# Altium project Christmas Project.PrjPcb
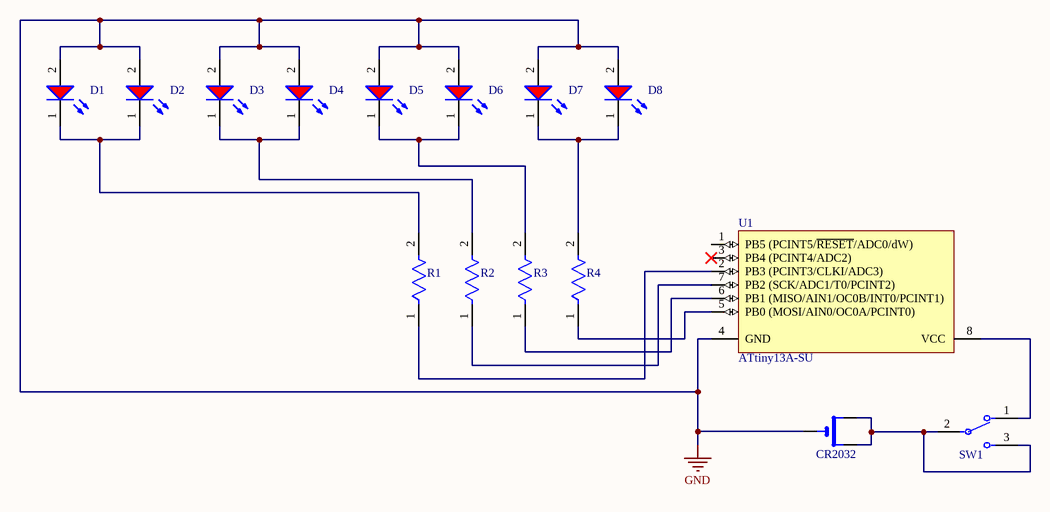
[diagram p0: Christmas_SCH.SchDoc]
1 sheet, 15 parts. Net scope: global (net labels, ports and power ports of the same name join across sheets).
Board files: Christmas_PCB.PcbDoc, Christmas_PCB_V2.PcbDoc

## Sheet Christmas_SCH.SchDoc
size A4; SheetNumber: 1; SheetTotal: 1

### Parts
?  CR2032  [CR2032-SMD]
D1  150080RS75000  [WL-SMCW_0805_150080xx75000]  (value not drawn)
D2  150080RS75000  [WL-SMCW_0805_150080xx75000]  (value not drawn)
D3  150080RS75000  [WL-SMCW_0805_150080xx75000]  (value not drawn)
D4  150080RS75000  [WL-SMCW_0805_150080xx75000]  (value not drawn)
D5  150080RS75000  [WL-SMCW_0805_150080xx75000]  (value not drawn)
D6  150080RS75000  [WL-SMCW_0805_150080xx75000]  (value not drawn)
D7  150080RS75000  [WL-SMCW_0805_150080xx75000]  (value not drawn)
D8  150080RS75000  [WL-SMCW_0805_150080xx75000]  (value not drawn)
R1  CRCW0805330RFKEA  [FP-CRCW0805-e3-MFG]  (value not drawn)
R2  CRCW0805330RFKEA  [FP-CRCW0805-e3-MFG]  (value not drawn)
R3  CRCW0805330RFKEA  [FP-CRCW0805-e3-MFG]  (value not drawn)
R4  CRCW0805330RFKEA  [FP-CRCW0805-e3-MFG]  (value not drawn)
SW1  JS102011SAQN  [FP-JS102011SAQN-MFG]  (value not drawn)
U1  ATtiny13A-SU  [8S2_L]

### Nets
GND: ?.NEG D1.2(A) D2.2(A) D3.2(A) D4.2(A) D5.2(A) D6.2(A) D7.2(A) D8.2(A) U1.4(GND)
Net?_+$1: ?.+$1(POS) ?.+$2(+1) SW1.2(C) SW1.3
NetD1_1: D1.1(K) D2.1(K) R1.2
NetD3_1: D3.1(K) D4.1(K) R2.2
NetD5_1: D5.1(K) D6.1(K) R3.2
NetD7_1: D7.1(K) D8.1(K) R4.2
NetR1_1: R1.1 U1.2(PB3_(PCINT3/CLKI/ADC3))
NetR2_1: R2.1 U1.7(PB2_(SCK/ADC1/T0/PCINT2))
NetR3_1: R3.1 U1.6(PB1_(MISO/AIN1/OC0B/INT0/PCINT1))
NetR4_1: R4.1 U1.5(PB0_(MOSI/AIN0/OC0A/PCINT0))
NetSW1_1: SW1.1 U1.8(VCC)

Not connected (* = marked no-connect by the designer): U1 1(PB5_(PCINT5/~{RESET}/ADC0/dW)) 3(PB4_(PCINT4/ADC2))*

### Library data of the parts
? = CR2032: Coin, 20.0mm Lithium Manganese Dioxide 3V Battery Non-Rechargeable _Primary_; MF: FDK America,; Availability: Unavailable; Price: None; Package: FDK; Value: *; SnapEDA_Link: https://www.snapeda.com/parts/CR2032/FDK%20America%2C%20Inc.%2C%20a%20member%20of%20Fujitsu%20Group/view-part/1775317/?ref=snap; MP: CR2032
D1-D8 = CMP-1426-00011-2: NexarPartId: 29717781; Peak Wavelength: 630nm; Wavelength: 625nm; Viewing Angle: 140°; Test Current: 20mA; Forward Voltage: 2V; Forward Current: 100mA; Lens Style: Clear, Rectangular; Color: Red; Luminous Intensity: 150mcd; Max Reverse Voltage (DC): 5V; Length: 2mm; Case Code (Imperial): 0805; RoHS: Compliant; Max Operating Temperature: 85°C; Height: 700µm; Packaging: Tape and Reel; Case/Package: 0805; REACH SVHC: Unknown; Dominant Wavelength: 625nm; Min Operating Temperature: -40°C; Case Code (Metric): 2012; Mount: Surface Mount; Width: 1.25mm
R1-R4 = CMP-2001-03823-2: RES Thick Film, 330Ω, 1%, 0.125W, 100ppm/°C, 0805; Voltage Rating (DC): 150V; Resistance: 330R; Max Power Dissipation: 125mW; Mount: Surface Mount; Packaging: Tape and Reel; Min Operating Temperature: -55°C; Military Standard: Not; Case Code (Metric): 2012; Height: 0.02inch; Voltage Rating: 150V; Case/Package: 0805; Max Operating Temperature: 155°C; Width: 0.049inch; Case Code (Imperial): 0805; Termination: SMD/SMT; Lead Free: Lead Free; Contact Plating: Tin; Package Quantity: 10; Composition: Thick Film; Length: 2mm; Features: Automotive AEC-Q200; Depth: 1.25mm; Weight: 0.000194oz; Tolerance: 1%; Power Rating: 125mW; Number of Terminations: 2; Temperature Coefficient: 100ppm/°C
SW1 = CMP-2000-06501-2: SWITCH SLIDE SPDT 300MA 6V; Switch Function: On-On; Illumination Type: Non-Illuminated; Switch Travel: 2mm; Contact Resistance: 70mR; Actuator Material: Nylon; Electrical Life: 5000Cycles; Actuator Type: Standard; Max Operating Temperature: 85°C; Housing Material: Nylon; Radiation Hardening: No; Max Voltage Rating (DC): 6V; Package Quantity: 1; Case/Package: 100; Actuator Length: 2mm; Min Operating Temperature: -40°C; Contact Current Rating: 300mA; REACH SVHC: No SVHC; Throw Configuration: SPDT; Packaging: Tape and Reel; Contact Material: Copper Alloy; Max Current Rating: 300mA; Current Rating: 300mA; Mount: Surface Mount; Lead Free: Lead Free; Termination: Gull Wing; Voltage Rating (DC): 6V; Length: 9mm; Orientation: Right Angle; Contact Plating: Silver
U1 = CMP-0093-00187-2: 8-bit AVR Microcontroller, 1.8-5.5V, 20MHz, 1KB Flash, 64 Bytes EEPROM, 64 Bytes SRAM, 8-pin SOIC, Industrial Grade (-40°C to 85°C), Pb-Free; ComponentLink3URL: http://www.atmel.com/dyn/resources/prod_documents/8126S.pdf; ComponentLink1URL: http://www.atmel.com/; ComponentLink2Description: ATtiny13A Datasheet; ComponentLink1Description: Manufacturer URL; ComponentLink2URL: http://www.atmel.com/dyn/resources/prod_documents/doc8126.pdf; ComponentLink3Description: ATtiny13A Summary; PackageDescription: 8-Lead, 0.208" Body, Plastic Small Outline Package (EIAJ); PackageVersion: revF, Apr-2008; RevisionNote: DatasheetVersion updated. URLs added.; DatasheetVersion: revE, Jul-2010; PackageReference: 8S2